# Altium schematic sheet ESC_Driver.SchDoc
size A3; SheetNumber: 4; SheetTotal: 6
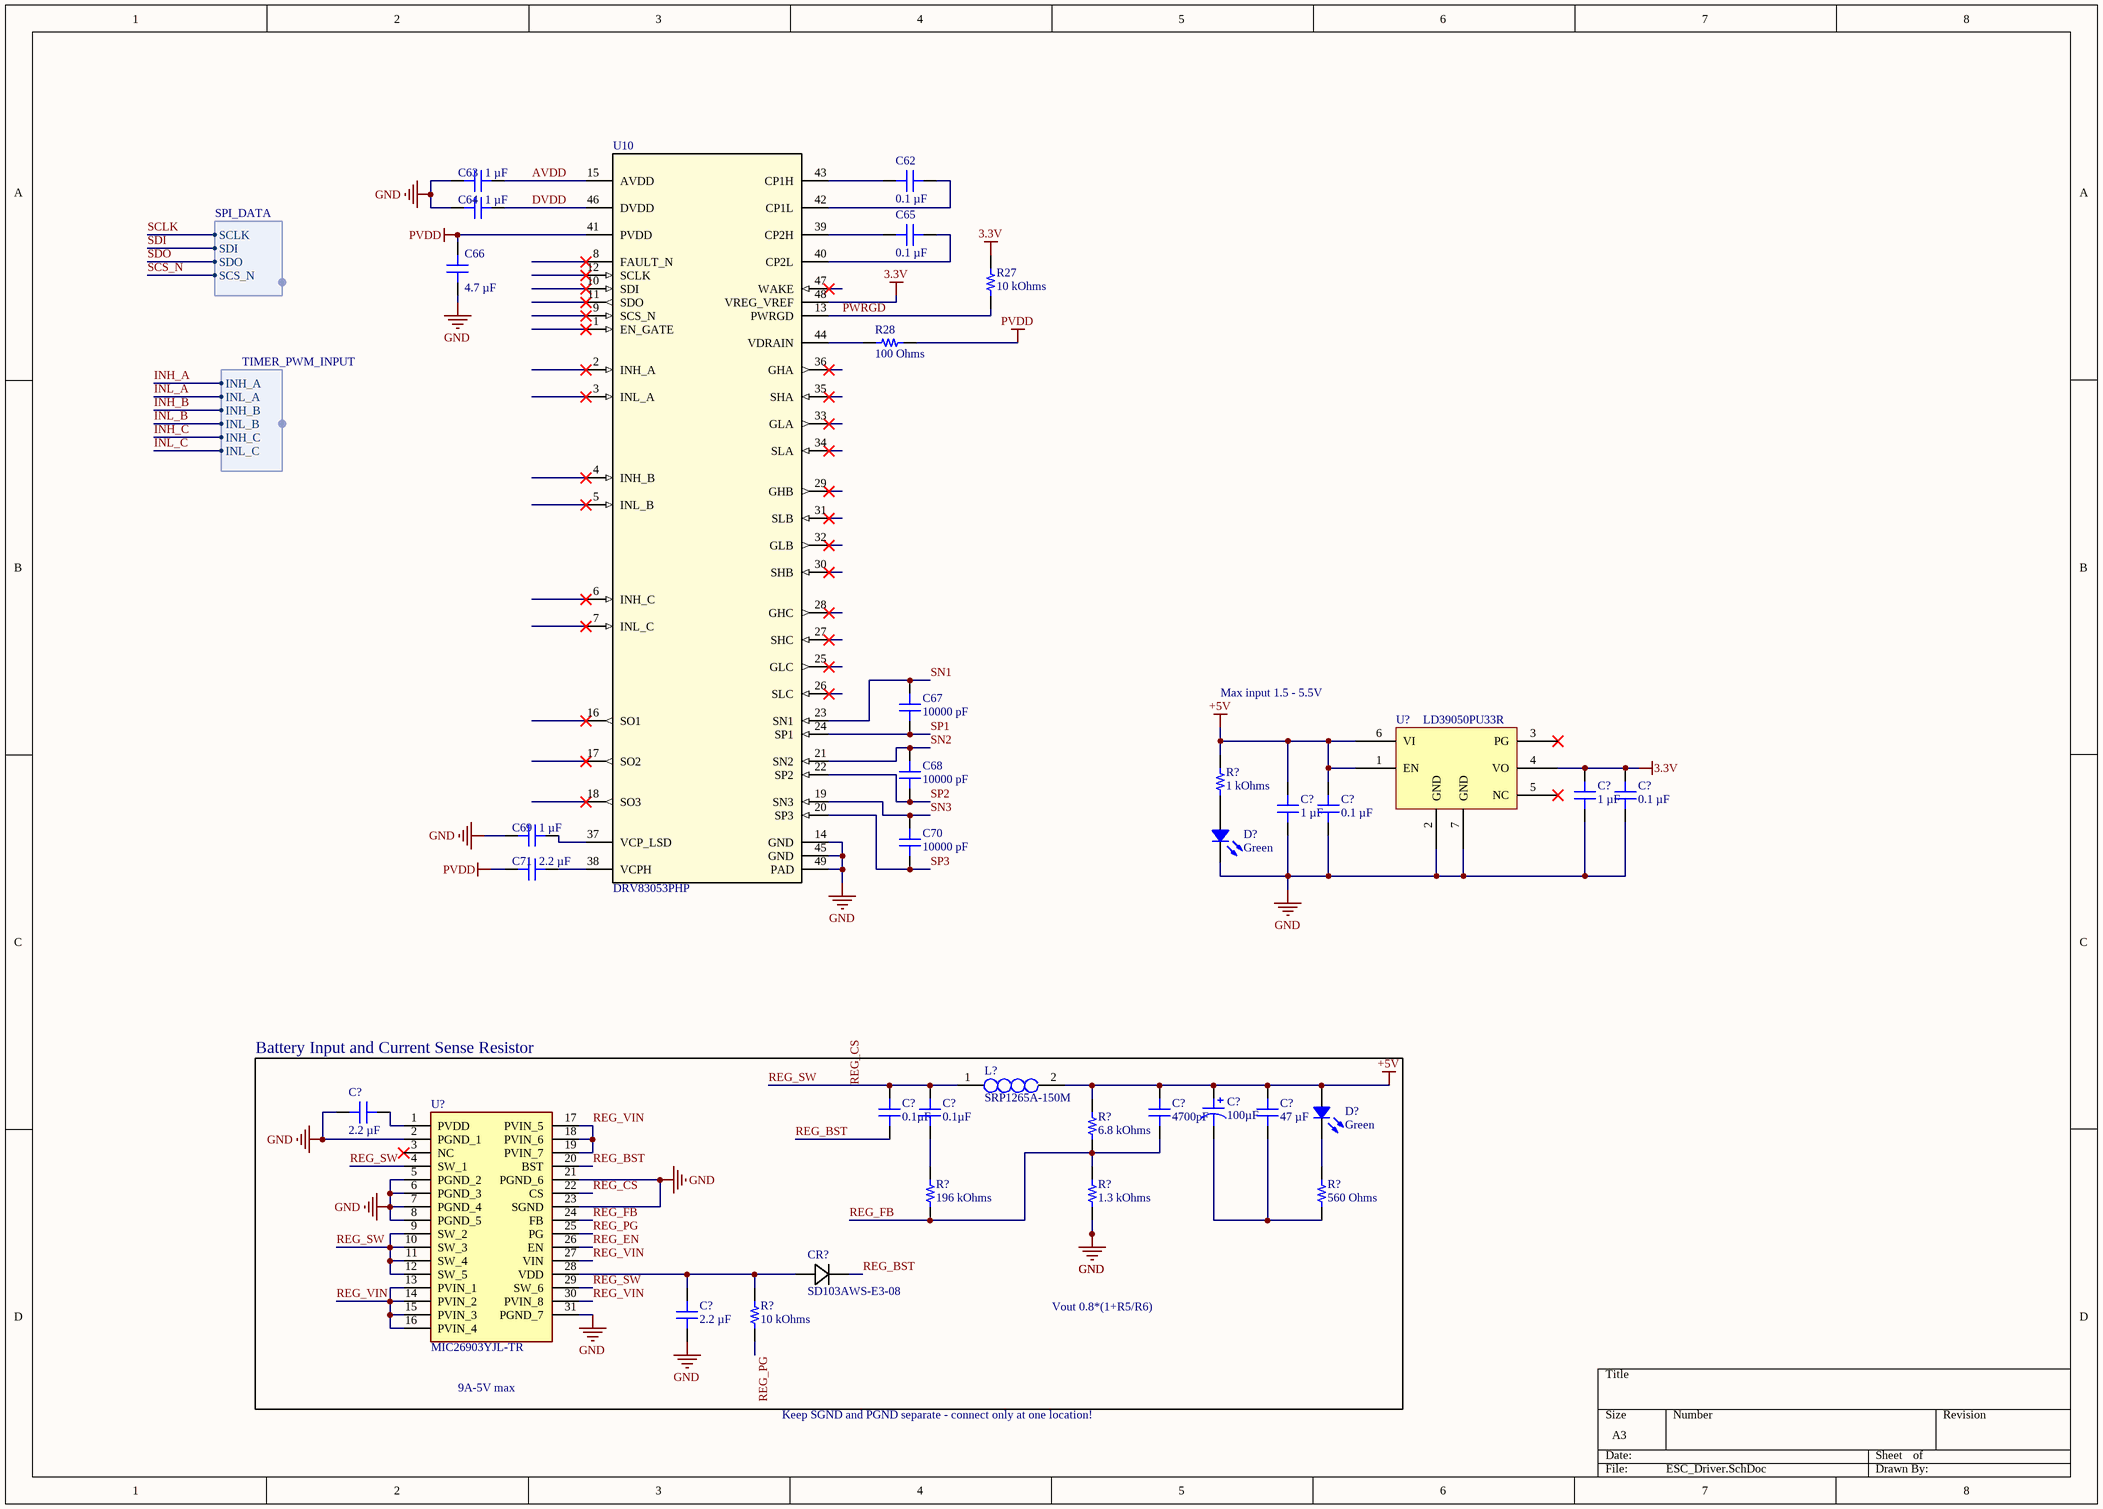
[diagram p0: ESC_Driver.SchDoc]

## Parts
(Parts that share a designator on the sheet are numbered #1, #2 ... from top to bottom, then left to right.)
C62  0.1 µF  [CAP 0603_1608]
C63  1 µF  [CAP 0603_1608]
C64  1 µF  [CAP 0603_1608]
C65  0.1 µF  [CAP 0603_1608]
C66  4.7 µF  [CAP 1206_3216 - 0.8MM]
C67  10000 pF  [CAP 0603_1608]
C68  10000 pF  [CAP 0603_1608]
C69  1 µF  [CAP 0603_1608]
C70  10000 pF  [CAP 0603_1608]
C71  2.2 µF  [CAP 1210_3225 - 1MM]
C?#1  1 µF  [CAP 0603_1608]
C?#2  0.1 µF  [CAP 0603_1608]
C?#3  1 µF  [CAP 0603_1608]
C?#4  0.1 µF  [CAP 0603_1608]
C?#5  2.2 µF  [CAP 0603_1608]
C?#6  0.1µF  [CAP 0805_2012]
C?#7  0.1µF  [CAP 0805_2012]
C?#8  4700pF  [CAP 0805_2012]
C?#9  100µF  [CAP ALSMD 6.6MM H8.0MM]
C?#10  47 µF  [CAP 1210_3225 - 1MM]
C?#11  2.2 µF  [CAP 0603_1608]
CR?  SD103AWS-E3-08  [CR_WS-E3-08_VIS]
D?#1  Green  [LED 0603_1608 GREEN]
D?#2  Green  [LED 0603_1608 GREEN]
L?  SRP1265A-150M  [INDPM135125X650N]
R27  10 kOhms  [RES 0603_1608]
R28  100 Ohms  [RES 0603_1608]
R?#1  1 kOhms  [RES 0603_1608]
R?#2  6.8 kOhms  [RES 0805_2012]
R?#3  196 kOhms  [RES 0805_2012]
R?#4  1.3 kOhms  [RES 0805_2012]
R?#5  560 Ohms  [RES 0603_1608]
R?#6  10 kOhms  [RES 0805_2012]
U10  DRV83053PHP  [PHP0048G_N]
U?#1  LD39050PU33R  [DFN6_3X3_STM]
U?#2  MIC26903YJL-TR  [MIC24054YJLTR]

## Blocks framed on the sheet
Battery Input and Current Sense Resistor: C?#5-C?#11 CR? D?#2 L? R?#2-R?#6 U?#2

## Harnesses
SPI_DATA: SCLK, SDI, SDO, SCS_N
TIMER_PWM_INPUT: INH_A, INL_A, INH_B, INL_B, INH_C, INL_C

## Nets
3.3V: C?#1.2 C?#2.2 R27.2 U10.48(VREG_VREF) U?#1.4(VO)
+5V: C?#3.2 C?#4.2 C?#8.2 C?#9.1 C?#10.2 D?#2.1 L?.2 R?#1.2 R?#2.2 U?#1.1(EN) U?#1.6(VI)
GND: C63.2 C64.2 C66.1 C69.2 C?#1.1 C?#2.1 C?#3.1 C?#4.1 C?#5.1 C?#11.1 D?#1.2 R?#4.1 U10.14(GND) U10.45(GND) U10.49(PAD) U?#1.2(GND) U?#1.7(GND) U?#2.2(PGND_1) U?#2.5(PGND_2) U?#2.6(PGND_3) U?#2.7(PGND_4) U?#2.8(PGND_5) U?#2.21(PGND_6) U?#2.23(SGND) U?#2.31(PGND_7)
PVDD: C66.2 C71.1 R28.2 U10.41(PVDD)
AVDD: C63.1 U10.15(AVDD)
DVDD: C64.1 U10.46(DVDD)
INH_A: harness TIMER_PWM_INPUT.INH_A
INH_B: harness TIMER_PWM_INPUT.INH_B
INH_C: harness TIMER_PWM_INPUT.INH_C
INL_A: harness TIMER_PWM_INPUT.INL_A
INL_B: harness TIMER_PWM_INPUT.INL_B
INL_C: harness TIMER_PWM_INPUT.INL_C
PWRGD: R27.1 U10.13(PWRGD)
REG_BST: C?#6.1 CR?.1 U?#2.20(BST)
REG_CS: C?#6.2 C?#7.2 L?.1 U?#2.4(SW_1) U?#2.9(SW_2) U?#2.10(SW_3) U?#2.11(SW_4) U?#2.12(SW_5) U?#2.22(CS) U?#2.29(SW_6)  [also labelled REG_SW]
REG_EN: U?#2.26(EN)
REG_FB: C?#8.1 R?#2.1 R?#3.1 R?#4.2 U?#2.24(FB)
REG_PG: R?#6.2 U?#2.25(PG)
REG_VIN: U?#2.13(PVIN_1) U?#2.14(PVIN_2) U?#2.15(PVIN_3) U?#2.16(PVIN_4) U?#2.17(PVIN_5) U?#2.18(PVIN_6) U?#2.19(PVIN_7) U?#2.27(VIN) U?#2.30(PVIN_8)
SCLK: harness SPI_DATA.SCLK
SCS_N: harness SPI_DATA.SCS_N
SDI: harness SPI_DATA.SDI
SDO: harness SPI_DATA.SDO
SN1: C67.1 U10.23(SN1)
SN2: C68.2 U10.21(SN2)
SN3: C70.2 U10.19(SN3)
SP1: C67.2 U10.24(SP1)
SP2: C68.1 U10.22(SP2)
SP3: C70.1 U10.20(SP3)
NetC62_1: C62.1 U10.43(CP1H)
NetC62_2: C62.2 U10.42(CP1L)
NetC65_1: C65.1 U10.39(CP2H)
NetC65_2: C65.2 U10.40(CP2L)
NetC69_1: C69.1 U10.37(VCP_LSD)
NetC71_2: C71.2 U10.38(VCPH)
NetC?#5_2: C?#5.2 U?#2.1(PVDD)
NetC?#7_1: C?#7.1 R?#3.2
NetC?#9_2: C?#9.2 C?#10.1 R?#5.1
NetC?#11_2: C?#11.2 CR?.2 R?#6.1 U?#2.28(VDD)
NetD?#1_1: D?#1.1 R?#1.1
NetD?#2_2: D?#2.2 R?#5.2
NetR28_1: R28.1 U10.44(VDRAIN)

Not connected (* = marked no-connect by the designer): U10 1(EN_GATE)* 2(INH_A)* 3(INL_A)* 4(INH_B)* 5(INL_B)* 6(INH_C)* 7(INL_C)* 8(FAULT_N)* 9(SCS_N)* 10(SDI)* 11(SDO)* 12(SCLK)* 16(SO1)* 17(SO2)* 18(SO3)* 25(GLC)* 26(SLC)* 27(SHC)* 28(GHC)* 29(GHB)* 30(SHB)* 31(SLB)* 32(GLB)* 33(GLA)* 34(SLA)* 35(SHA)* 36(GHA)* 47(WAKE)*; U?#1 3(PG)* 5(NC)*; U?#2 3(NC)*

## Notes on the sheet
- Max input 1.5 - 5.5V
- Vout 0.8*(1+R5/R6)
- 9A-5V max
- Keep SGND and PGND separate - connect only at one location!

## Library data of the parts
C62 C65 = GRM188R72A104KA35D: CAP CER 0.1UF 100V X7R 0603; manufacturer: Murata Electronics; Tolerance: ±10%; Part Number: GRM188R72A104KA35D; Value: 0.1 µF; Applications: General Purpose; Capacitance: 0.1 µF; componentlink1description: Datasheet; componentlink1url: https://www.murata.com/~/media/webrenewal/support/library/catalog/products/capacitor/mlcc/c02e.ashx?la=en-us; componentlink2description: DigiKey Link; componentlink2url: https://www.digikey.com/en/products/detail/murata-electronics/GRM188R72A104KA35D/702549; Device Package: 0603 (1608 Metric); lastupdated: 11.08.2022 08:55:49; Lifecycle Status: Active; Minimum Order: 1; Mounting Type: Surface Mount, MLCC; Operating Temperature: -55°C ~ 125°C; Package / Case: 0603 (1608 Metric); packaging: TapeAndReel; partid: 9563; Part Status: Active; price: 0.04; series: GRM; Size / Dimension: 0.063" L x 0.031" W (1.60mm x 0.80mm); Supplier 1: DigiKey; Supplier Part Number 1: 490-3285-1-ND; Temperature Coefficient: X7R; Thickness (Max): 0.035" (0.90mm); Voltage - Rated: 100V
C63 C64 C69 = C1608X7R1C105K080AC: CAP CER 1UF 16V X7R 0603; manufacturer: TDK Corporation; Tolerance: ±10%; Part Number: C1608X7R1C105K080AC; Value: 1 µF; Applications: General Purpose; Capacitance: 1 µF; componentlink1description: Datasheet; componentlink1url: https://product.tdk.com/info/en/catalog/datasheets/mlcc_commercial_general_en.pdf?ref_disty=digikey; componentlink2description: DigiKey Link; componentlink2url: https://www.digikey.com/en/products/detail/tdk-corporation/C1608X7R1C105K080AC/634395; Device Package: 0603 (1608 Metric); Features: Low ESL; lastupdated: 11.08.2022 08:55:09; Lifecycle Status: Active; Minimum Order: 1; Mounting Type: Surface Mount, MLCC; Operating Temperature: -55°C ~ 125°C; Package / Case: 0603 (1608 Metric); packaging: TapeAndReel; partid: 36324; Part Status: Active; price: 0.01; series: C; Size / Dimension: 0.063" L x 0.031" W (1.60mm x 0.80mm); Supplier 1: DigiKey; Supplier Part Number 1: 445-1604-1-ND; Temperature Coefficient: X7R; Thickness (Max): 0.035" (0.90mm); Voltage - Rated: 16V
C66 = GRM31CR71H475MA12L: CAP CER 4.7UF 50V X7R 1206; manufacturer: Murata Electronics; Tolerance: ±20%; Part Number: GRM31CR71H475MA12L; Value: 4.7 µF; Applications: General Purpose; Capacitance: 4.7 µF; componentlink1description: Datasheet; componentlink1url: https://www.murata.com/~/media/webrenewal/support/library/catalog/products/capacitor/mlcc/c02e.ashx?la=en-us; componentlink2description: DigiKey Link; componentlink2url: https://www.digikey.com/en/products/detail/murata-electronics/GRM31CR71H475MA12L/2548210; Device Package: 1206 (3216 Metric); lastupdated: 11.08.2022 09:01:07; Lifecycle Status: Active; Minimum Order: 1; Mounting Type: Surface Mount, MLCC; Operating Temperature: -55°C ~ 125°C; Package / Case: 1206 (3216 Metric); packaging: TapeAndReel; partid: 20011; Part Status: Active; price: 0.19; series: GRM; Size / Dimension: 0.126" L x 0.063" W (3.20mm x 1.60mm); Supplier 1: DigiKey; Supplier Part Number 1: 490-6522-1-ND; Temperature Coefficient: X7R; Thickness (Max): 0.071" (1.80mm); Voltage - Rated: 50V
C67 C68 C70 = VJ0603Y103KXJCW1BC: CAP CER 10000PF 16V X7R 0603; manufacturer: Vishay Vitramon; Tolerance: ±10%; Part Number: VJ0603Y103KXJCW1BC; Value: 10000 pF; Applications: General Purpose; Capacitance: 10000 pF; componentlink1description: Datasheet; componentlink1url: https://www.vishay.com/docs/28548/vjw1bcbascomseries.pdf; componentlink2description: DigiKey Link; componentlink2url: https://www.digikey.com/en/products/detail/vishay-vitramon/VJ0603Y103KXJCW1BC/8305282; Device Package: 0603 (1608 Metric); lastupdated: 11.08.2022 08:55:11; Lifecycle Status: Active; Minimum Order: 1; Mounting Type: Surface Mount, MLCC; Operating Temperature: -55°C ~ 125°C; Package / Case: 0603 (1608 Metric); packaging: TapeAndReel; partid: 26244; Part Status: Active; price: 0.02; series: VJ; Size / Dimension: 0.063" L x 0.031" W (1.60mm x 0.80mm); Supplier 1: DigiKey; Supplier Part Number 1: 720-VJ0603Y103KXJCW1BCCT-ND; Temperature Coefficient: X7R; Thickness (Max): 0.034" (0.87mm); Voltage - Rated: 16V
C71 = HMJ325AB7225KMHP: CAP CER 2.2UF 100V X7R 1210; manufacturer: Taiyo Yuden; Tolerance: ±10%; Part Number: HMJ325AB7225KMHP; Value: 2.2 µF; Applications: Automotive, SMPS Filtering, Boardflex Sensitive; Capacitance: 2.2 µF; componentlink1description: Datasheet; componentlink1url: https://www.yuden.co.jp/productdata/catalog//mlcc11_hq_e.pdf; componentlink2description: DigiKey Link; componentlink2url: https://www.digikey.com/en/products/detail/taiyo-yuden/HMJ325AB7225KMHP/6563571; Device Package: 1210 (3225 Metric); Features: Soft Termination; lastupdated: 11.08.2022 09:14:31; Lifecycle Status: Active; Minimum Order: 1; Mounting Type: Surface Mount, MLCC; Operating Temperature: -55°C ~ 125°C; Package / Case: 1210 (3225 Metric); packaging: TapeAndReel; partid: 24012; Part Status: Active; price: 0.32; Ratings: AEC-Q200; series: M; Size / Dimension: 0.126" L x 0.098" W (3.20mm x 2.50mm); Supplier 1: DigiKey; Supplier Part Number 1: 587-4978-1-ND; Temperature Coefficient: X7R; Thickness (Max): 0.110" (2.80mm); Voltage - Rated: 100V
C?#1 C?#3 = CL10A105KO8NNNC: CAP CER 1UF 16V X5R 0603; manufacturer: Samsung Electro-Mechanics; Tolerance: ±10%; Part Number: CL10A105KO8NNNC; Value: 1 µF; Applications: General Purpose; Capacitance: 1 µF; componentlink1description: Datasheet; componentlink1url: http://www.samsungsem.com/kr/support/product-search/mlcc/CL10A105KO8NNNC.jsp; componentlink2description: DigiKey Link; componentlink2url: https://www.digikey.com/en/products/detail/samsung-electro-mechanics/CL10A105KO8NNNC/3886692; Device Package: 0603 (1608 Metric); lastupdated: 2.03.2023 20:08:41; Lifecycle Status: Active; Minimum Order: 1; Mounting Type: Surface Mount, MLCC; Operating Temperature: -55°C ~ 85°C; Package / Case: 0603 (1608 Metric); packaging: TapeAndReel; partid: 5514; Part Status: Active; price: 0.01; series: CL; Size / Dimension: 0.063" L x 0.031" W (1.60mm x 0.80mm); Supplier 1: DigiKey; Supplier Part Number 1: 1276-1034-1-ND; Temperature Coefficient: X5R; Thickness (Max): 0.035" (0.90mm); Voltage - Rated: 16V
C?#2 C?#4 = CC0603KRX7R7BB104: CAP CER 0.1UF 16V X7R 0603; manufacturer: Yageo; Tolerance: ±10%; Part Number: CC0603KRX7R7BB104; Value: 0.1 µF; Applications: General Purpose; Capacitance: 0.1 µF; componentlink1description: Datasheet; componentlink1url: https://www.yageo.com/upload/media/product/productsearch/datasheet/mlcc/UPY-GPHC_X7R_6.3V-to-50V_18.pdf; componentlink2description: DigiKey Link; Device Package: 0603 (1608 Metric); lastupdated: 20.02.2023 20:07:33; Lifecycle Status: Active; Minimum Order: 1; Mounting Type: Surface Mount, MLCC; Operating Temperature: -55°C ~ 125°C; Package / Case: 0603 (1608 Metric); packaging: TapeAndReel; partid: 16746; Part Status: Active; price: 0.01; series: CC; Size / Dimension: 0.063" L x 0.031" W (1.60mm x 0.80mm); Supplier 1: DigiKey; Supplier Part Number 1: 311-1088-1-ND; Temperature Coefficient: X7R; Thickness (Max): 0.035" (0.90mm); Voltage - Rated: 16V
C?#5 C?#11 = CL10A225KO8NNNC: CAP CER 2.2UF 16V X5R 0603; manufacturer: Samsung Electro-Mechanics; Tolerance: ±10%; Part Number: CL10A225KO8NNNC; Value: 2.2 µF; Applications: General Purpose; Capacitance: 2.2 µF; componentlink1description: Datasheet; componentlink1url: http://www.samsungsem.com/kr/support/product-search/mlcc/CL10A225KO8NNNC.jsp; componentlink2description: DigiKey Link; componentlink2url: https://www.digikey.com/en/products/detail/samsung-electro-mechanics/CL10A225KO8NNNC/3886698; Device Package: 0603 (1608 Metric); lastupdated: 25.08.2022 06:49:32; Lifecycle Status: Active; Minimum Order: 1; Mounting Type: Surface Mount, MLCC; Operating Temperature: -55°C ~ 85°C; Package / Case: 0603 (1608 Metric); packaging: TapeAndReel; partid: 5651; Part Status: Active; price: 0.01; series: CL; Size / Dimension: 0.063" L x 0.031" W (1.60mm x 0.80mm); Supplier 1: DigiKey; Supplier Part Number 1: 1276-1040-1-ND; Temperature Coefficient: X5R; Thickness (Max): 0.035" (0.90mm); Voltage - Rated: 16V
C?#6 C?#7 = C0805X104K5RAC3316: CAP CER 0805 0.1UF 50V X7R; Manufacturer: KEMET; Tolerance: ±10%; Part Number: C0805X104K5RAC3316; Value: 0.1µF; Applications: Automotive, Boardflex Sensitive; Capacitance: 0.1µF; ComponentLink1Description: Datasheet; ComponentLink1URL: https://api.kemet.com/component-edge/download/datasheet/C0805X104K5RAC3316.pdf; ComponentLink2Description: DigiKey Link; ComponentLink2URL: http://digikey.com/product-detail/en/kemet/C0805X104K5RAC3316/399-C0805X104K5RAC3316CT-ND/10315823; Device Package: 0805 (2012 Metric); Features: Soft Termination; LastUpdated: 2.09.2020 01:04:41; Lifecycle Status: Active; Minimum Order: 1; Mounting Type: Surface Mount, MLCC; Operating Temperature: -55°C ~ 125°C; Package / Case: 0805 (2012 Metric); Packaging: TapeAndReel; PartId: 2769; Part Status: Active; Price: 0.08; Ratings: AEC-Q200; Series: SMD Auto X7R VW80808; Size / Dimension: 0.079" L x 0.049" W (2.00mm x 1.25mm); Supplier 1: DigiKey; Supplier Part Number 1: 399-C0805X104K5RAC3316CT-ND; Temperature Coefficient: X7R; Thickness (Max): 0.047" (1.20mm); Voltage - Rated: 50V
C?#8 = C0805C472J3GAC7800: CAP CER 4700PF 25V NP0 0805; Manufacturer: KEMET; Temperature Coefficient: C0G, NP0; Tolerance: ±5%; Part Number: C0805C472J3GAC7800; Value: 4700pF; Applications: General Purpose; Capacitance: 4700pF; ComponentLink1Description: Datasheet; ComponentLink1URL: https://api.kemet.com/component-edge/download/datasheet/C0805C472J3GACTU.pdf; ComponentLink2Description: DigiKey Link; ComponentLink2URL: http://digikey.com/product-detail/en/kemet/C0805C472J3GAC7800/399-15504-1-ND/7386902; Device Package: 0805 (2012 Metric); Features: Low ESL; LastUpdated: 2.09.2020 01:04:35; Lifecycle Status: Active; Minimum Order: 1; Mounting Type: Surface Mount, MLCC; Operating Temperature: -55°C ~ 125°C; Package / Case: 0805 (2012 Metric); Packaging: TapeAndReel; PartId: 6164; Part Status: Active; Price: 0.14; Series: SMD Comm C0G; Size / Dimension: 0.079" L x 0.049" W (2.00mm x 1.25mm); Supplier 1: DigiKey; Supplier Part Number 1: 399-15504-1-ND; Thickness (Max): 0.043" (1.10mm); Voltage - Rated: 25V
C?#9 = EMHK350ADA101MF80G: CAP POLY 100UF 20% 35V SMD; Manufacturer: United Chemi-Con; ESR (Equivalent Series Resistance): 300mOhm @ 400kHz; Lifetime @ Temp.: 2000 Hrs @ 125°C; Polarization: Polar; Ripple Current @ High Frequency: 240mA @ 400kHz; Ripple Current @ Low Frequency: 96mA @ 120Hz; Surface Mount Land Size: 0.260" L x 0.260" W (6.60mm x 6.60mm); Part Number: EMHK350ADA101MF80G; Applications: Automotive; Capacitance: 100µF; ComponentLink1Description: Datasheet; ComponentLink1URL: http://www.chemi-con.co.jp/cgi-bin/CAT_DB/SEARCH/cat_db_al.cgi?e=e&j=p&pdfname=mhk; ComponentLink2Description: DigiKey Link; ComponentLink2URL: http://digikey.com/product-detail/en/united-chemi-con/EMHK350ADA101MF80G/565-4328-1-ND/5824843; Device Package: Radial, Can - SMD; Height - Seated (Max): 0.315" (8.00mm); LastUpdated: 2.09.2020 01:25:38; Lifecycle Status: Active; Minimum Order: 1; Mounting Type: Surface Mount; Operating Temperature: -40°C ~ 125°C; Package / Case: Radial, Can - SMD; Packaging: TapeAndReel; PartId: 8422; Part Status: Active; Price: 0.23; Ratings: AEC-Q200; Series: Alchip™- MHK; Size / Dimension: 0.248" Dia (6.30mm); Supplier 1: DigiKey; Supplier Part Number 1: 565-4328-1-ND; Tolerance: ±20%; Value: 100µF; Voltage - Rated: 35V
C?#10 = 12103D476MAT2A: CAP CER 47UF 25V X5R 1210; manufacturer: KYOCERA AVX; Tolerance: ±20%; Part Number: 12103D476MAT2A; Value: 47 µF; Applications: General Purpose; Capacitance: 47 µF; componentlink2description: DigiKey Link; componentlink2url: https://www.digikey.com/en/products/detail/kyocera-avx/12103D476MAT2A/11231511; Device Package: 1210 (3225 Metric); lastupdated: 25.08.2022 07:12:28; Lifecycle Status: Active; Minimum Order: 1; Mounting Type: Surface Mount, MLCC; Operating Temperature: -55°C ~ 85°C; Package / Case: 1210 (3225 Metric); packaging: TapeAndReel; partid: 44412; Part Status: Active; price: 1.09; series: -; Size / Dimension: 0.126" L x 0.098" W (3.20mm x 2.50mm); Supplier 1: DigiKey; Supplier Part Number 1: 478-12103D476MAT2ACT-ND; Temperature Coefficient: X5R; Thickness (Max): 0.110" (2.79mm); Voltage - Rated: 25V
CR? = SD103AWS-E3-08: No Description Available; Mfr_Name: Vishay; Type: DEV; Copyright: Copyright (C) 2022 Ultra Librarian. All rights reserved.; Manufacturer_Part_Number: SD103AWS-E3-08; RefDes: RefDes
D?#1 = 150060VS73220: LED GREEN CLEAR 0603 SMD; Manufacturer: Würth Elektronik; Configuration: Standard; Current - Test: 20mA; Lens Color: Colorless; Lens Size: 1.60mm x 0.80mm; Lens Style: Rectangle with Flat Top; Millicandela Rating: 60mcd; Viewing Angle: 120°; Voltage - Forward (Vf) (Typ): 2V; Wavelength - Dominant: 573nm; Wavelength - Peak: 575nm; Part Number: 150060VS73220; Color: Green; ComponentLink1Description: Datasheet; ComponentLink1URL: https://katalog.we-online.de/pbs/datasheet/150060VS73220.pdf; ComponentLink2Description: DigiKey Link; ComponentLink2URL: http://digikey.com/product-detail/en/w-rth-elektronik/150060VS73220/732-11997-1-ND/8557207; Device Package: 0603 (1608 Metric); Height (Max): 0.25mm; LastUpdated: 2.09.2020 01:20:42; Lens Transparency: Clear; Lifecycle Status: Active; Minimum Order: 1; Mounting Type: Surface Mount; Package / Case: 0603 (1608 Metric); Packaging: TapeAndReel; PartId: 653; Part Status: Active; Price: 0.17; Series: WL-SMCC; Size / Dimension: 1.60mm L x 0.80mm W; Supplier 1: DigiKey; Supplier Part Number 1: 732-11997-1-ND; Supplier Device Package: 0603 (1608 Metric); Value: Green
D?#2 = 5990081007F: LED GREEN 0603 SMD; Manufacturer: Dialight; Configuration: Standard; Current - Test: 20mA; Lens Color: 0.80mm; Lens Size: 1.10mm x 0.80mm; Lens Style: Rectangle with Flat Top; Millicandela Rating: 340mcd; Viewing Angle: 140°; Voltage - Forward (Vf) (Typ): 3.1V; Wavelength - Dominant: 525nm; Part Number: 5990081007F; Color: Green; ComponentLink1Description: Datasheet; ComponentLink1URL: http://www.dialightsignalsandcomponents.com/Assets/Brochures_And_Catalogs/Indication/CBI_SMD_new/Dialight_CBI_data_599-0603_Apr2018.pdf; ComponentLink2Description: DigiKey Link; ComponentLink2URL: http://digikey.com/product-detail/en/dialight/5990081007F/350-4351-1-ND/9385457; Device Package: 0603 (1608 Metric); Height (Max): 0.80mm; LastUpdated: 2.09.2020 01:20:42; Lifecycle Status: Active; Minimum Order: 1; Mounting Type: Surface Mount; Package / Case: 0603 (1608 Metric); Packaging: TapeAndReel; PartId: 650; Part Status: Active; Price: 0.15; Series: 599; Size / Dimension: 1.60mm L x 0.80mm W; Supplier 1: DigiKey; Supplier Part Number 1: 350-4351-1-ND; Supplier Device Package: 0603; Value: Green
L? = SRP1265A-150M: Inductor; Manufacturer_Name: Bourns; Datasheet Link: https://www.bourns.com/docs/Product-Datasheets/SRP1265A.pdf; Height: 6.5mm; Manufacturer_Part_Number: SRP1265A-150M; Mouser Part Number: 652-SRP1265A-150M; Mouser Price/Stock: https://www.mouser.co.uk/ProductDetail/Bourns/SRP1265A-150M?qs=7z%252BmIopC6%2FLSy0nqMGUhRA%3D%3D; Arrow Part Number: SRP1265A-150M; Arrow Price/Stock: https://www.arrow.com/en/products/srp1265a-150m/bourns?region=nac
R27 = CRCW060310K0JNEA: RES SMD 10K OHM 5% 1/10W 0603; Manufacturer: Vishay Dale; Power (Watts): 0.1W, 1/10W; Temperature Coefficient: ±200ppm/°C; Part Number: CRCW060310K0JNEA; Value: 10 kOhms; ComponentLink1Description: Datasheet; ComponentLink1URL: http://www.vishay.com/docs/20035/dcrcwe3.pdf; ComponentLink2Description: DigiKey Link; ComponentLink2URL: http://digikey.com/product-detail/en/vishay-dale/CRCW060310K0JNEA/541-10KGCT-ND/1179393; Composition: Thick Film; Device Package: 0603 (1608 Metric); Features: Automotive AEC-Q200; Height - Seated (Max): 0.020" (0.50mm); LastUpdated: 11.08.2022 09:13:49; Lifecycle Status: Active; Minimum Order: 1; Number of Terminations: 2; Operating Temperature: -55°C ~ 155°C; Package / Case: 0603 (1608 Metric); Packaging: CutTape; PartId: 5216; Part Status: Active; Price: 0.10; Ratings: AEC-Q200; Resistance: 10 kOhms; Series: CRCW; Size / Dimension: 0.063" L x 0.033" W (1.60mm x 0.85mm); Supplier 1: DigiKey; Supplier Part Number 1: 541-10KGCT-ND; Supplier Device Package: 0603; Tolerance: ±5%
R28 = CRCW0603100RJNEA: RES SMD 100 OHM 5% 1/10W 0603; Manufacturer: Vishay Dale; Power (Watts): 0.1W, 1/10W; Temperature Coefficient: ±200ppm/°C; Part Number: CRCW0603100RJNEA; Value: 100 Ohms; ComponentLink1Description: Datasheet; ComponentLink1URL: http://www.vishay.com/docs/20035/dcrcwe3.pdf; ComponentLink2Description: DigiKey Link; ComponentLink2URL: http://digikey.com/product-detail/en/vishay-dale/CRCW0603100RJNEA/541-100GCT-ND/1179345; Composition: Thick Film; Device Package: 0603 (1608 Metric); Features: Automotive AEC-Q200; Height - Seated (Max): 0.020" (0.50mm); LastUpdated: 11.08.2022 09:13:17; Lifecycle Status: Active; Minimum Order: 1; Number of Terminations: 2; Operating Temperature: -55°C ~ 155°C; Package / Case: 0603 (1608 Metric); Packaging: CutTape; PartId: 21193; Part Status: Active; Price: 0.10; Ratings: AEC-Q200; Resistance: 100 Ohms; Series: CRCW; Size / Dimension: 0.063" L x 0.033" W (1.60mm x 0.85mm); Supplier 1: DigiKey; Supplier Part Number 1: 541-100GCT-ND; Supplier Device Package: 0603; Tolerance: ±5%
R?#1 = RC0603FR-071KL: RES SMD 1K OHM 1% 1/10W 0603; Manufacturer: Yageo; Power (Watts): 0.1W, 1/10W; Temperature Coefficient: ±100ppm/°C; Part Number: RC0603FR-071KL; Value: 1 kOhms; ComponentLink1Description: Datasheet; ComponentLink1URL: https://www.yageo.com/upload/media/product/productsearch/datasheet/rchip/PYu-RC_Group_51_RoHS_L_10.pdf; ComponentLink2Description: DigiKey Link; ComponentLink2URL: http://digikey.com/product-detail/en/yageo/RC0603FR-071KL/311-1.00KHRCT-ND/729790; Composition: Thick Film; Device Package: 0603 (1608 Metric); Features: Moisture Resistant; Height - Seated (Max): 0.022" (0.55mm); LastUpdated: 2.09.2020 01:09:45; Lifecycle Status: Active; Minimum Order: 1; Number of Terminations: 2; Operating Temperature: -55°C ~ 155°C; Package / Case: 0603 (1608 Metric); Packaging: CutTape; PartId: 22600; Part Status: Active; Price: 0.10; Resistance: 1 kOhms; Series: RC; Size / Dimension: 0.063" L x 0.031" W (1.60mm x 0.80mm); Supplier 1: DigiKey; Supplier Part Number 1: 311-1.00KHRCT-ND; Supplier Device Package: 0603; Tolerance: ±1%
R?#2 = SG73S2ATTD6801F: RES 6.8K OHM 1% 1/4W 0805; Manufacturer: KOA Speer Electronics, Inc.; Power (Watts): 0.25W, 1/4W; Temperature Coefficient: ±200ppm/°C; Part Number: SG73S2ATTD6801F; Value: 6.8 kOhms; ComponentLink1Description: Datasheet; ComponentLink1URL: http://www.koaspeer.com/catimages/Products/SG73S/SG73S.pdf; ComponentLink2Description: DigiKey Link; ComponentLink2URL: http://digikey.com/product-detail/en/koa-speer-electronics-inc/SG73S2ATTD6801F/2019-SG73S2ATTD6801FCT-ND/10280010; Composition: Thick Film; Device Package: 0805 (2012 Metric); Features: Automotive AEC-Q200, Moisture Resistant, Pulse Withstanding; Height - Seated (Max): 0.024" (0.60mm); LastUpdated: 2.09.2020 01:14:56; Lifecycle Status: Active; Minimum Order: 1; Number of Terminations: 2; Operating Temperature: -55°C ~ 155°C; Package / Case: 0805 (2012 Metric); Packaging: TapeAndReel; PartId: 40456; Part Status: Active; Price: 0.02; Ratings: AEC-Q200; Resistance: 6.8 kOhms; Series: SG73S; Size / Dimension: 0.079" L x 0.049" W (2.00mm x 1.25mm); Supplier 1: DigiKey; Supplier Part Number 1: 2019-SG73S2ATTD6801FCT-ND; Supplier Device Package: 0805; Tolerance: ±1%
R?#3 = ERA-6AEB1963V: RES 196K OHM 0.1% 1/8W 0805; Manufacturer: Panasonic Electronic Components; Power (Watts): 0.125W, 1/8W; Temperature Coefficient: ±25ppm/°C; Part Number: ERA-6AEB1963V; Value: 196 kOhms; ComponentLink1Description: Datasheet; ComponentLink1URL: https://industrial.panasonic.com/cdbs/www-data/pdf/RDM0000/AOA0000C307.pdf; ComponentLink2Description: DigiKey Link; ComponentLink2URL: http://digikey.com/product-detail/en/panasonic-electronic-components/ERA-6AEB1963V/P196KDACT-ND/3075009; Composition: Thin Film; Device Package: 0805 (2012 Metric); Features: Automotive AEC-Q200; Height - Seated (Max): 0.024" (0.60mm); LastUpdated: 2.09.2020 01:15:23; Lifecycle Status: Active; Minimum Order: 1; Number of Terminations: 2; Operating Temperature: -55°C ~ 155°C; Package / Case: 0805 (2012 Metric); Packaging: TapeAndReel; PartId: 28209; Part Status: Active; Price: 0.04; Ratings: AEC-Q200; Resistance: 196 kOhms; Series: ERA-6A; Size / Dimension: 0.079" L x 0.049" W (2.00mm x 1.25mm); Supplier 1: DigiKey; Supplier Part Number 1: P196KDACT-ND; Supplier Device Package: 0805; Tolerance: ±0.1%
R?#4 = RC0805FR-071K3L: RES SMD 1.3K OHM 1% 1/8W 0805; Manufacturer: Yageo; Power (Watts): 0.125W, 1/8W; Temperature Coefficient: ±100ppm/°C; Part Number: RC0805FR-071K3L; Value: 1.3 kOhms; ComponentLink1Description: Datasheet; ComponentLink1URL: https://www.yageo.com/upload/media/product/productsearch/datasheet/rchip/PYu-RC_Group_51_RoHS_L_10.pdf; ComponentLink2Description: DigiKey Link; ComponentLink2URL: http://digikey.com/product-detail/en/yageo/RC0805FR-071K3L/311-1.30KCRCT-ND/730425; Composition: Thick Film; Device Package: 0805 (2012 Metric); Features: Moisture Resistant; Height - Seated (Max): 0.024" (0.60mm); LastUpdated: 2.09.2020 01:14:58; Lifecycle Status: Active; Minimum Order: 1; Number of Terminations: 2; Operating Temperature: -55°C ~ 155°C; Package / Case: 0805 (2012 Metric); Packaging: CutTape; PartId: 39544; Part Status: Active; Price: 0.10; Resistance: 1.3 kOhms; Series: RC; Size / Dimension: 0.079" L x 0.049" W (2.00mm x 1.25mm); Supplier 1: DigiKey; Supplier Part Number 1: 311-1.30KCRCT-ND; Supplier Device Package: 0805; Tolerance: ±1%
R?#5 = ERJ-PA3F5600V: RES SMD 560 OHM 1% 1/4W 0603; Manufacturer: Panasonic Electronic Components; Power (Watts): 0.25W, 1/4W; Temperature Coefficient: ±100ppm/°C; Part Number: ERJ-PA3F5600V; Value: 560 Ohms; ComponentLink1Description: Datasheet; ComponentLink1URL: https://industrial.panasonic.com/cdbs/www-data/pdf/RDO0000/AOA0000C331.pdf; ComponentLink2Description: DigiKey Link; ComponentLink2URL: http://digikey.com/product-detail/en/panasonic-electronic-components/ERJ-PA3F5600V/P560BYCT-ND/5036204; Composition: Thick Film; Device Package: 0603 (1608 Metric); Features: Automotive AEC-Q200, Pulse Withstanding; Height - Seated (Max): 0.022" (0.55mm); LastUpdated: 2.09.2020 01:09:53; Lifecycle Status: Active; Minimum Order: 1; Number of Terminations: 2; Operating Temperature: -55°C ~ 155°C; Package / Case: 0603 (1608 Metric); Packaging: TapeAndReel; PartId: 19324; Part Status: Active; Price: 0.02; Ratings: AEC-Q200; Resistance: 560 Ohms; Series: ERJ; Size / Dimension: 0.063" L x 0.031" W (1.60mm x 0.80mm); Supplier 1: DigiKey; Supplier Part Number 1: P560BYCT-ND; Supplier Device Package: 0603; Tolerance: ±1%
R?#6 = SG73S2ATTD103J: RES 10K OHM 5% 1/4W 0805; Manufacturer: KOA Speer Electronics, Inc.; Power (Watts): 0.25W, 1/4W; Temperature Coefficient: ±200ppm/°C; Part Number: SG73S2ATTD103J; Value: 10 kOhms; ComponentLink1Description: Datasheet; ComponentLink1URL: http://www.koaspeer.com/catimages/Products/SG73S/SG73S.pdf; ComponentLink2Description: DigiKey Link; ComponentLink2URL: http://digikey.com/product-detail/en/koa-speer-electronics-inc/SG73S2ATTD103J/2019-SG73S2ATTD103JCT-ND/10280158; Composition: Thick Film; Device Package: 0805 (2012 Metric); Features: Automotive AEC-Q200, Moisture Resistant, Pulse Withstanding; Height - Seated (Max): 0.024" (0.60mm); LastUpdated: 2.09.2020 01:14:56; Lifecycle Status: Active; Minimum Order: 1; Number of Terminations: 2; Operating Temperature: -55°C ~ 155°C; Package / Case: 0805 (2012 Metric); Packaging: TapeAndReel; PartId: 40412; Part Status: Active; Price: 0.01; Ratings: AEC-Q200; Resistance: 10 kOhms; Series: SG73S; Size / Dimension: 0.079" L x 0.049" W (2.00mm x 1.25mm); Supplier 1: DigiKey; Supplier Part Number 1: 2019-SG73S2ATTD103JCT-ND; Supplier Device Package: 0805; Tolerance: ±5%
U10 = DRV83053PHP: No Description Available; Mfr_Name: Texas Instruments; PartNumber: DRV83053PHPR; CompType: IC; Type: DEV; RefDes: RefDes; Copyright: Copyright (C) 2022 Ultra Librarian. All rights reserved.; Manufacturer_Part_Number: DRV83053PHP; Application_BuildNumber: *; Alternate_PartNumber: DRV83053PHP; PackageReference: PHP0048G; MountType: SMT; RoHS: Y; Manufacturer: Texas Instruments
U?#1 = LD39050P
U?#2 = MIC26903YJL-TR: Integrated Circuit; Manufacturer_Name: Microchip; Datasheet Link: http://www.mouser.com/datasheet/2/268/MIC26903-778571.pdf; Height: 2mm; Manufacturer_Part_Number: MIC26903YJL-TR; Mouser Part Number: 998-MIC26903YJLTR; Mouser Price/Stock: https://www.mouser.co.uk/ProductDetail/Microchip-Technology-Micrel/MIC26903YJL-TR?qs=Y3Q3JoKAO1SmLxVK4D3Efg%3D%3D; Arrow Part Number: MIC26903YJL-TR; Arrow Price/Stock: https://www.arrow.com/en/products/mic26903yjl-tr/microchip-technology?region=nac